# EAGLE design 3001_i2c_voltera (EAGLE 9.6.2)
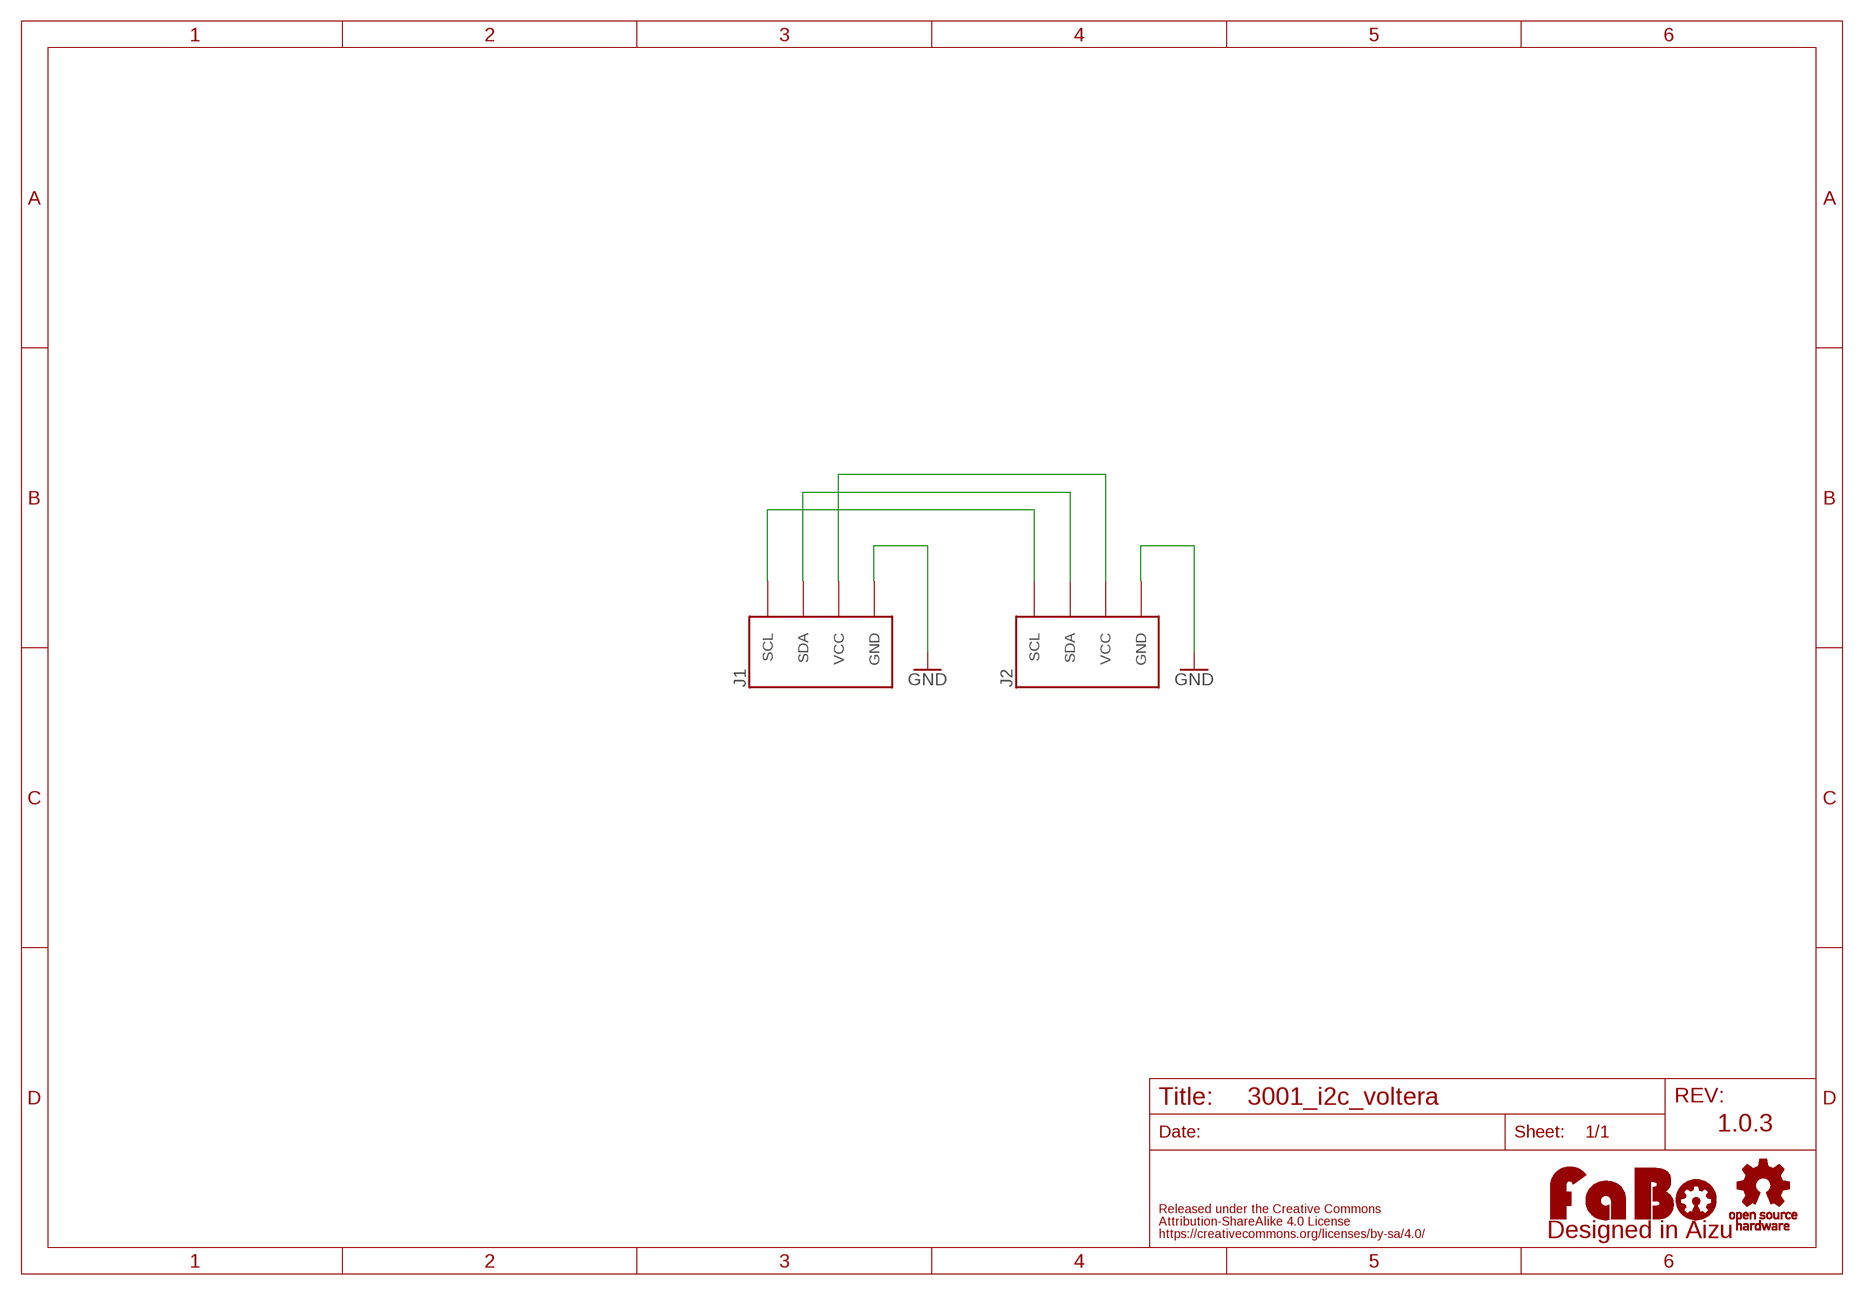
[diagram p0: schematic, sheet 1]

## Parts
J1  FABO_BRICK_I2C-VOLTERA-BASE  [FABO_BRICK_I2C_VOLTERA_BASE]
J2  FABO_BRICK_I2C-VOLTERA-PAD  [FABO_BRICK_I2C_VOLTERA_PAD]
U$2  LOGO_OSHW-M_BOTTOM  [LOGO_OSHW_M_BOTTOM]
U$3  LOGO_FABO-S  [LOGO_FABO_S]

## Nets
GND: J1.GND J2.GND
N$3: J1.SCL J2.SCL
N$4: J1.SDA J2.SDA
N$5: J1.VCC J2.VCC

## Notes on the sheet
- 1.0.3

## Library data of the parts
J1 J2 = FaBo-Template:FABO_BRICK_I2C: FaBo Brick I2C
U$2 = FaBo-Logo:LOGO_OSHW
U$3 = FaBo-Logo:LOGO_FABO

## Board
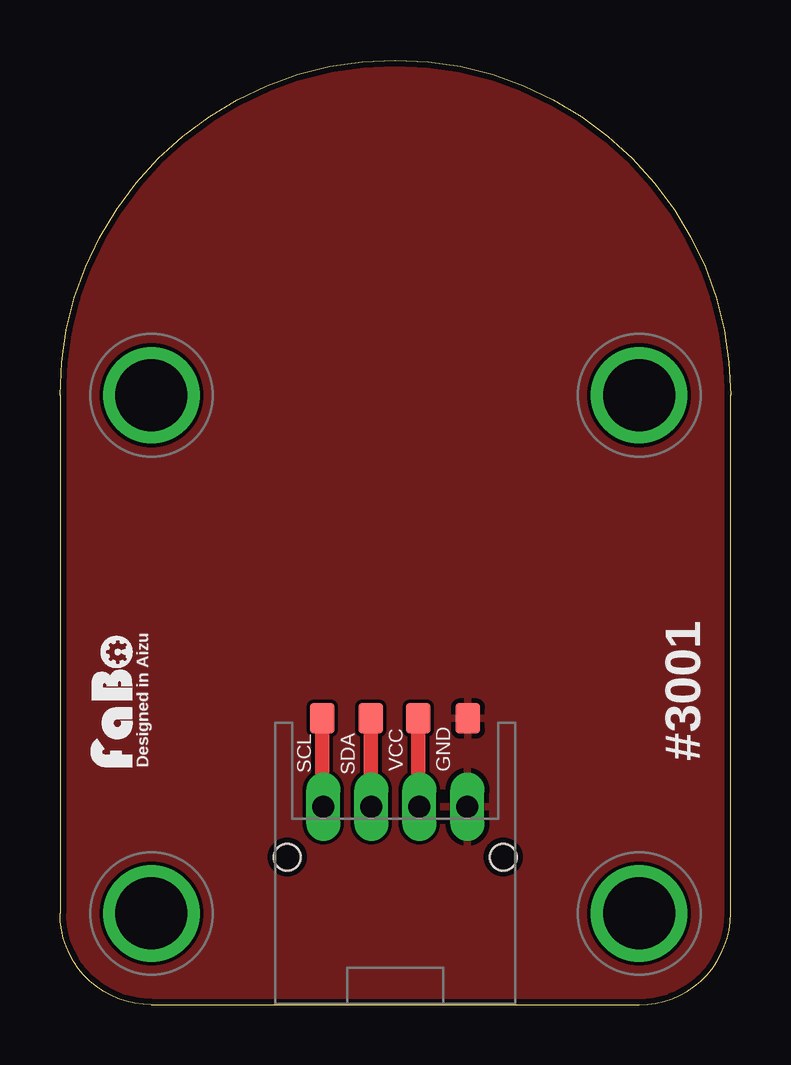
[diagram p1: board, top side]
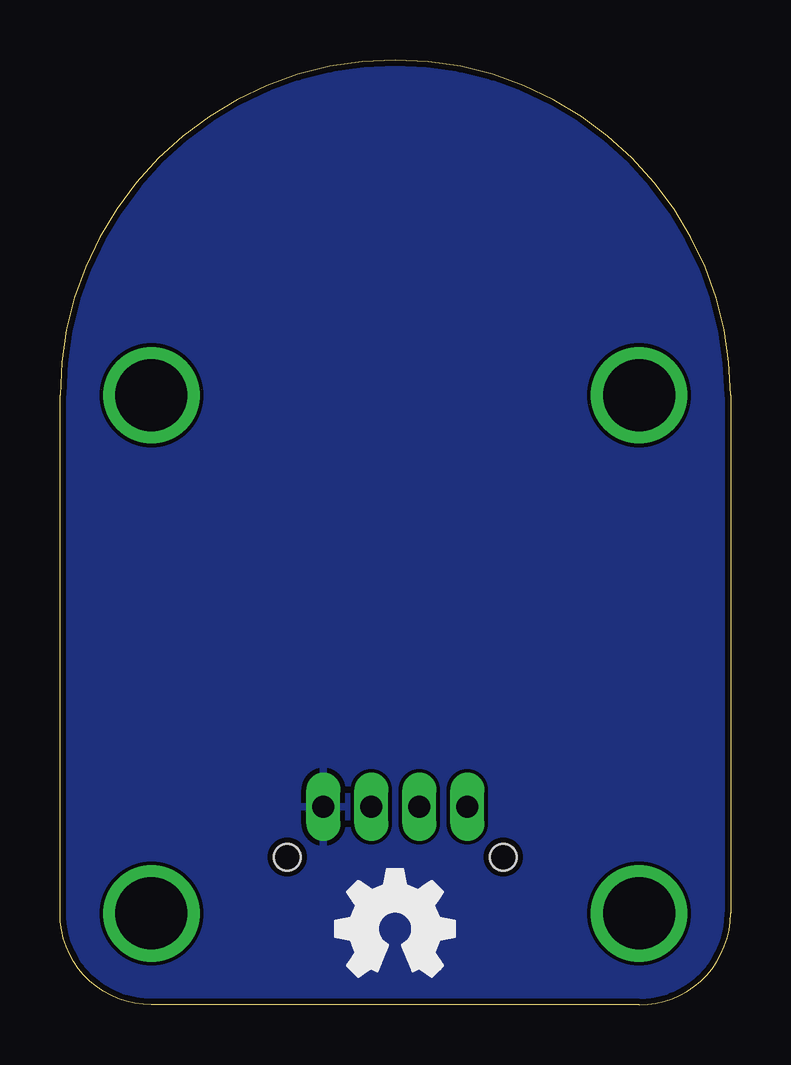
[diagram p2: board, bottom side, seen from below]

Size 27.94 x 39.37 mm. Coordinates in mm from the lower left corner, seen from the top.
Copper layers (1*16): Top 0.035mm / dielectric 1.6mm / Bottom 0.035mm
Design rules "PCBway": minimum track width 6mil, minimum drill 12mil, track to track 6mil, track to pad 6mil, pad to pad 6mil, via to via 6mil, smd to smd 6mil, copper to edge 10mil, drill to drill 10mil, minimum pad ring 10mil, minimum via ring 6mil, stop-mask expansion 2mil, vias tented up to drill 100mil, thermal gap 8mil

### Footprints (pad centres in the part's own frame; a part is rotated, then mirrored left to right if it is on the bottom)
FABO_BRICK_I2C_VOLTERA_BASE = drill 0.9 pad 1.422 long: GND 3,-8.255; SCL -3,-8.255; SDA -1,-8.255; VCC 1,-8.255 | drill 3 pad 3.81: P$1 -10.16,8.89; P$2 10.16,8.89; P$3 -10.16,-12.7; P$4 10.16,-12.7 | hole 1.1: -4.5,-10.355; 4.5,-10.355
FABO_BRICK_I2C_VOLTERA_PAD = smd 1.016 x 1.27: GND 3.023,-4.572; SCL -3.048,-4.572; SDA -1.016,-4.572; VCC 0.965,-4.572

### Placement (x,y rotation side)
J1  13.97,16.51 0 top
J2  13.97,16.51 0 top
U$2  13.97,3.17 0 top
U$3  3.17,12.7 90 top

### Tracks (layer width: path | path; a pad name or v marks a point on that pad's centre or on a via)
GND
  pour Top (isolate 0.152, rank 3): 0,0 27.94,0 27.94,39.37 0,39.37
  pour Bottom (isolate 0.152, rank 3): 0,0 27.94,0 27.94,39.37 0,39.37
N$3
  Top 0.152: J1.SCL 10.92,8.3
  Top 0.61: 10.92,8.3 J2.SCL
N$4
  Top 0.61: J2.SDA 12.95,8.27 J1.SDA
N$5
  Top 0.61: J2.VCC 14.94,8.29 J1.VCC

### Text on the board
tPlace: Designed in Aizu | #3001